# EAGLE schematic jr pro reverb (EAGLE 6.6.0)
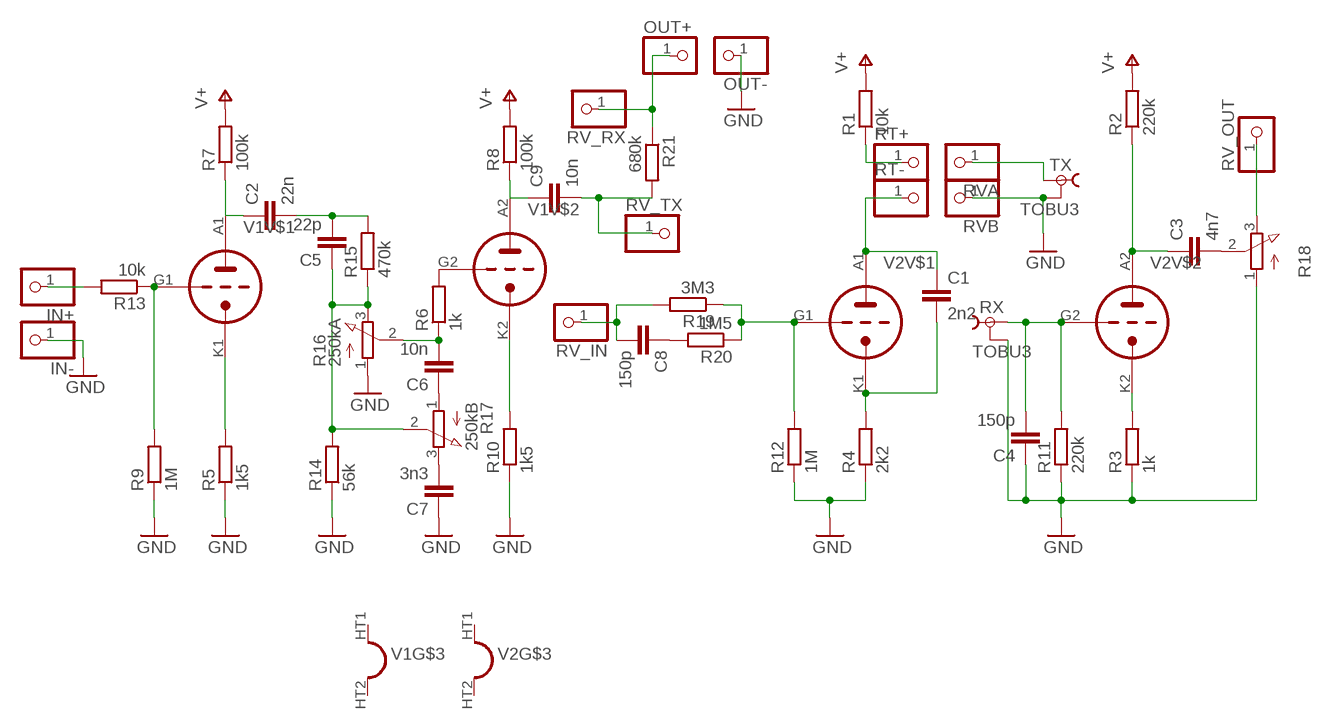
[diagram p0: schematic, sheet 1]

## Parts
C1  2n2  C-EU050-030X075  [C050-030X075]
C2  22n  C-EU050-045X075  [C050-045X075]
C3  4n7  C-EU050-045X075  [C050-045X075]
C4  150p  C-EU050-030X075  [C050-030X075]
C5  22p  C-EU050-030X075  [C050-030X075]
C6  10n  C-EU050-045X075  [C050-045X075]
C7  3n3  C-EU050-045X075  [C050-045X075]
C8  150p  C-EU050-030X075  [C050-030X075]
C9  10n  C-EU050-045X075  [C050-045X075]
IN+  PINHD-1X1  [1X01]
IN-  PINHD-1X1  [1X01]
OUT+  PINHD-1X1  [1X01]
OUT-  PINHD-1X1  [1X01]
R1  10k  R-EU_0207/7  [0207/7]
R2  220k  R-EU_0207/7  [0207/7]
R3  1k  R-EU_0207/7  [0207/7]
R4  2k2  R-EU_0207/7  [0207/7]
R5  1k5  R-EU_0207/7  [0207/7]
R6  1k  R-EU_0207/7  [0207/7]
R7  100k  R-EU_0207/7  [0207/7]
R8  100k  R-EU_0207/7  [0207/7]
R9  1M  R-EU_0207/7  [0207/7]
R10  1k5  R-EU_0207/7  [0207/7]
R11  220k  R-EU_0207/7  [0207/7]
R12  1M  R-EU_0207/7  [0207/7]
R13  10k  R-EU_0207/7  [0207/7]
R14  56k  R-EU_0207/7  [0207/7]
R15  470k  R-EU_0207/7  [0207/7]
R16  250kA  3RP/1610N  [3RP/1610N]
R17  250kB  3RP/1610N  [3RP/1610N]
R18  3RP/1610N  [3RP/1610N]
R19  3M3  R-EU_0207/7  [0207/7]
R20  1M5  R-EU_0207/7  [0207/7]
R21  680k  R-EU_0207/7  [0207/7]
RT+  PINHD-1X1  [1X01]
RT-  PINHD-1X1  [1X01]
RV_IN  PINHD-1X1  [1X01]
RV_OUT  PINHD-1X1  [1X01]
RV_RX  PINHD-1X1  [1X01]
RV_TX  PINHD-1X1  [1X01]
RVA  PINHD-1X1  [1X01]
RVB  PINHD-1X1  [1X01]
RX  TOBU3  [TOBU3]
TX  TOBU3  [TOBU3]
V1  6NXX-PIT  [6NXX-PIT]
V2  6NXX-PIT  [6NXX-PIT]

## Nets
GND: C4.1 C7.1 IN-.1 OUT-.1 R3.1 R4.1 R5.1 R9.1 R10.1 R11.1 R12.1 R14.1 R16.1(A) R18.1(A) RVB.1 RX.2 RX.2@1 RX.2@2 TX.2 TX.2@1 TX.2@2
N$1: C1.2 R4.2 V2.K1(V$1:TK)
N$2: R12.2 R19.1 R20.1 V2.G1(V$1:TG)
N$3: C4.2 R11.2 RX.1 V2.G2(V$2:TG)
N$4: R3.2 V2.K2(V$2:TK)
N$5: C8.1 R20.2
N$6: C9.1 R8.1 V1.A2(V$2:TA)
N$7: C2.1 R7.1 V1.A1(V$1:TA)
N$8: C3.1 R2.1 V2.A2(V$2:TA)
N$9: R1.1 RT+.1
N$10: C1.1 RT-.1 V2.A1(V$1:TA)
N$11: R5.2 V1.K1(V$1:TK)
N$12: RVA.1 TX.1
N$13: R10.2 V1.K2(V$2:TK)
N$14: R9.2 R13.1 V1.G1(V$1:TG)
N$15: R6.2 V1.G2(V$2:TG)
N$16: C6.2 R6.1 R16.2(S)
N$17: C6.1 R17.1(A)
N$18: C5.1 R14.2 R15.1 R16.3(E) R17.2(S)
N$19: OUT+.1 R21.1 RV_RX.1
N$20: C7.2 R17.3(E)
N$21: C2.2 C5.2 R15.2
N$22: C9.2 R21.2 RV_TX.1
N$23: C8.2 R19.2 RV_IN.1
N$24: C3.2 R18.2(S)
N$25: R18.3(E) RV_OUT.1
N$26: IN+.1 R13.2
V+: R1.2 R2.2 R7.2 R8.2
Unconnected: V1.HT1(H1) V1.HT2(H2) V2.HT1(H1) V2.HT2(H2)

## Library data of the parts
C1-C9 = rcl:C-EU: CAPACITOR, European symbol
IN+ IN- OUT+ OUT- RT+ RT- RV_IN RV_OUT RV_RX RV_TX RVA RVB = adafruit:PINHD-1X1: Pin header 1x1 for 0.1" spacing With round pins
R1-R15 R19-R21 = rcl:R-EU_: RESISTOR, European symbol
R16-R18 = pot:3RP/1610N: 16mm Potentiometer one level Source: http://www.alphapotentiometers.net/html/16mm_pot_2.html
RX TX = con-hirschmann:TOBU3: Female Cinch CONNECTOR ( RCA Jack ); MF: FARNELL; MPN: TOBU 3; OC_FARNELL: 592791; OC_NEWARK: 06WX5914
V1 V2 = tubesC:6NXX-PIT